# EAGLE design Versatile IO Card (EAGLE 6.5.0)
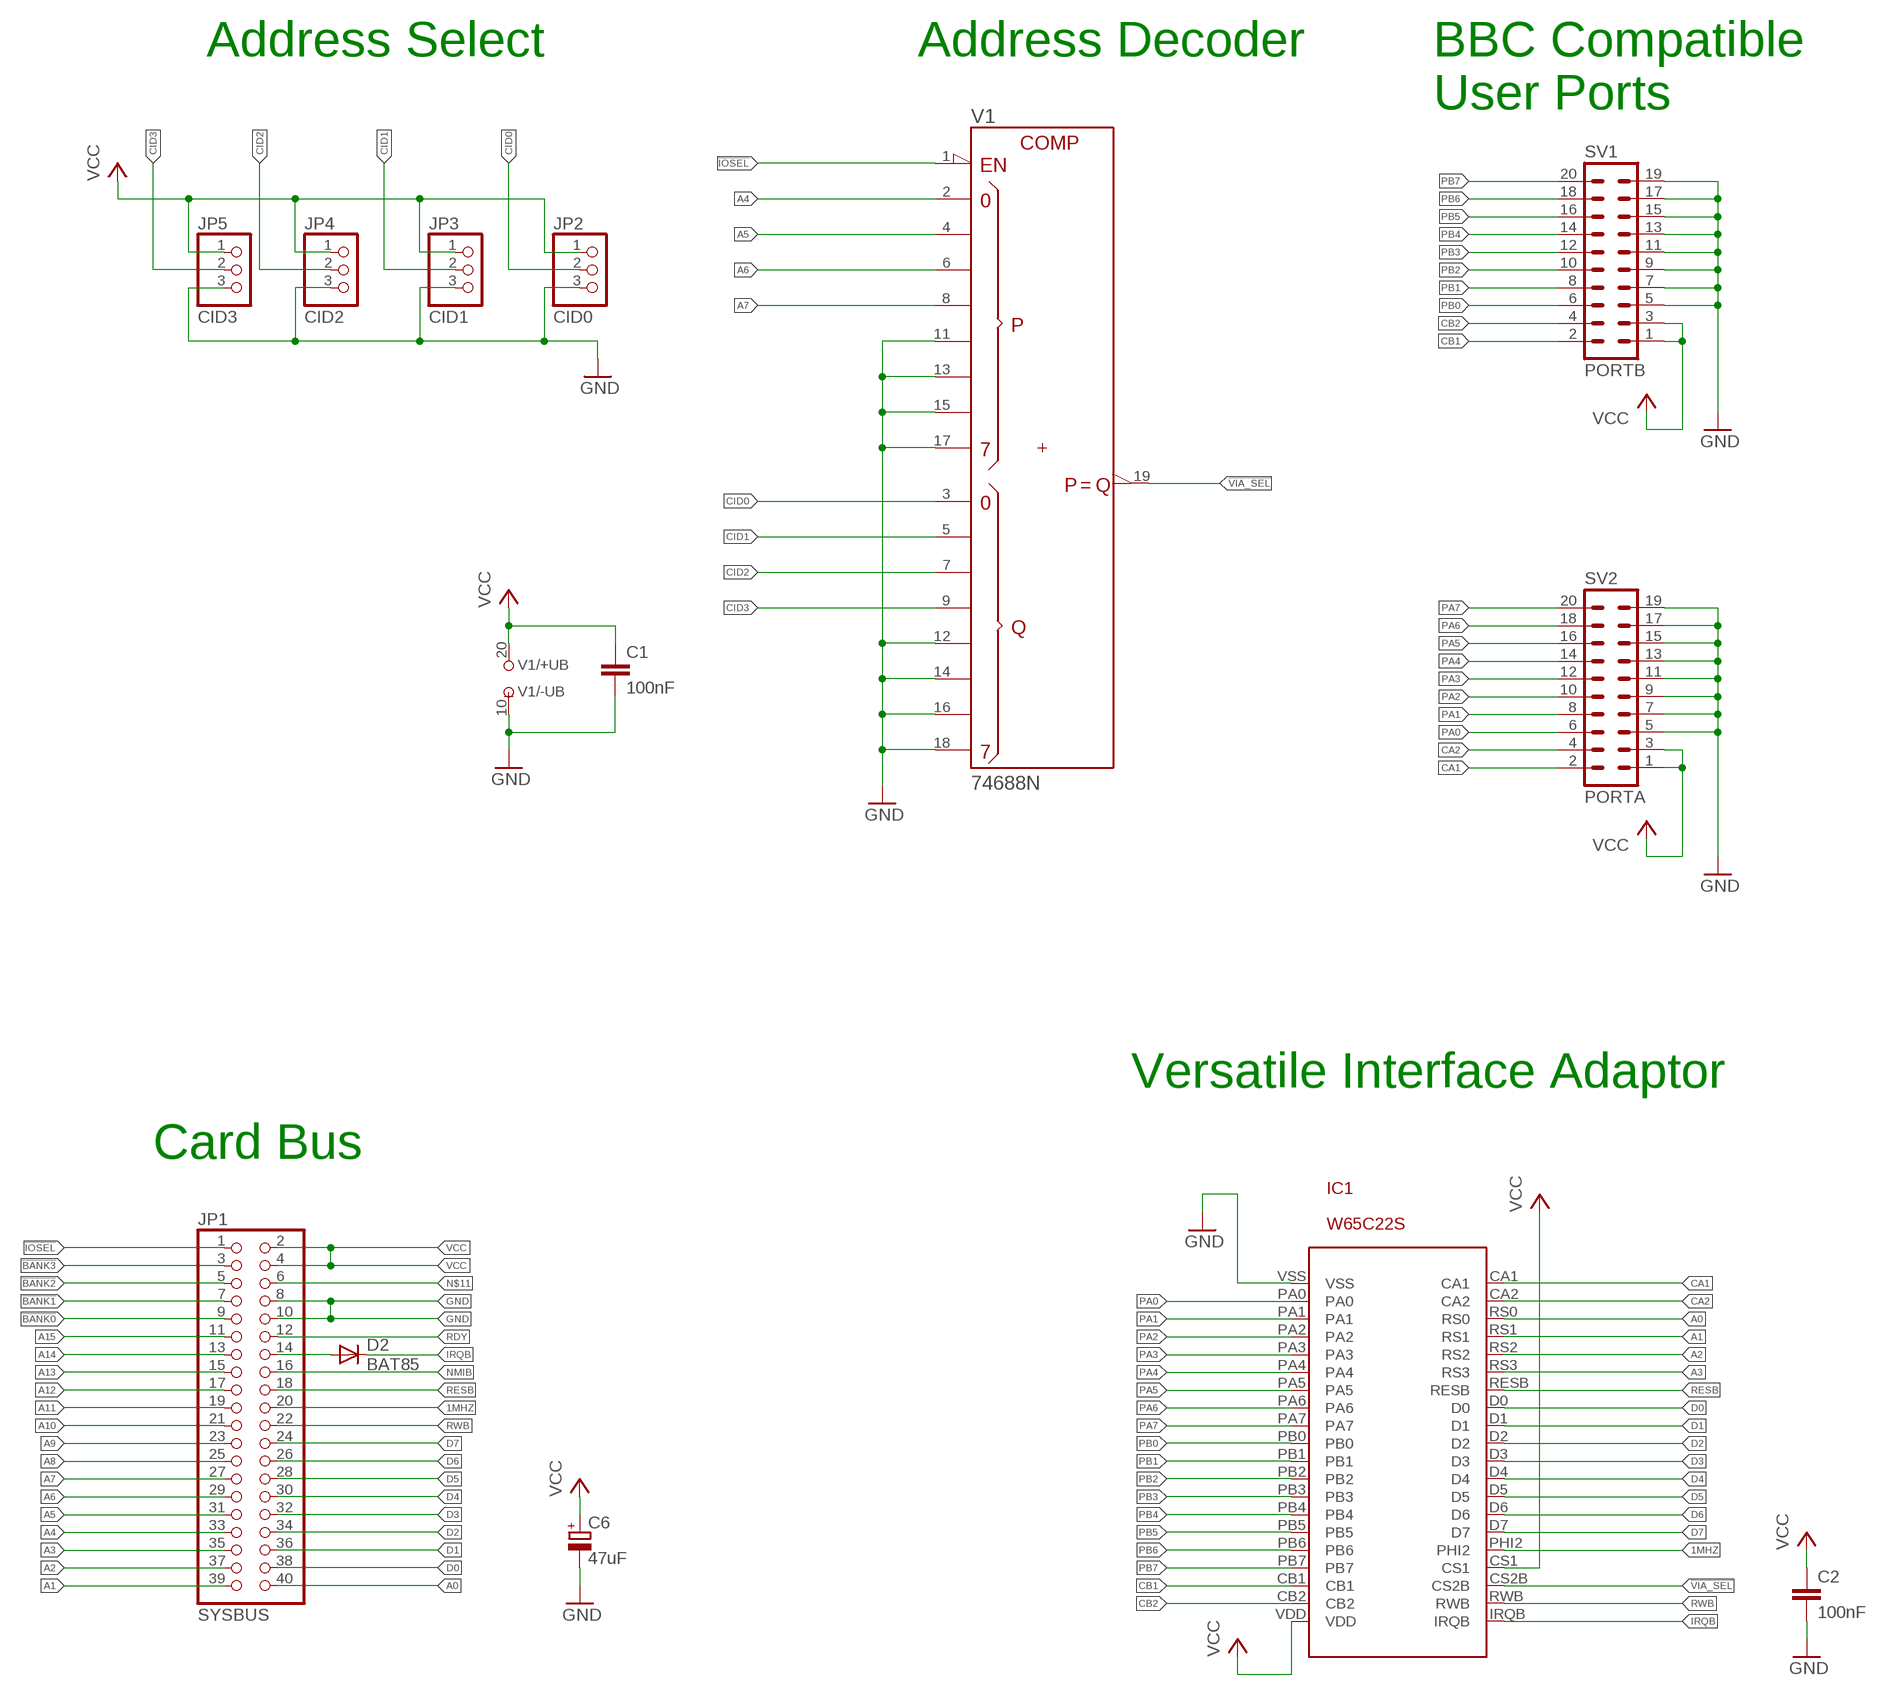
[diagram p0: schematic, sheet 1]

## Parts
C1  100nF  C-EU050-025X075  [C050-025X075]
C2  100nF  C-EU050-025X075  [C050-025X075]
C6  47uF  CPOL-EUE2.5-7  [E2,5-7]
D2  BAT85  BAT81  [DO34-7]
IC1  W65C22S  W65C22  [W65C22-DIP]
JP1  SYSBUS  PINHD-2X20/90  [2X20/90]
JP2  CID0  PINHD-1X3  [1X03]
JP3  CID1  PINHD-1X3  [1X03]
JP4  CID2  PINHD-1X3  [1X03]
JP5  CID3  PINHD-1X3  [1X03]
SV1  PORTB  ML20L  [ML20L]
SV2  PORTA  ML20L  [ML20L]
V1  74688N  [DIL20]

## Nets
1MHZ: IC1.PHI2 JP1.20
!BANK0: JP1.9
!BANK1: JP1.7
!BANK2: JP1.5
!BANK3: JP1.3
!IOSEL: JP1.1 V1.1(!G)
!VIA_SEL: IC1.CS2B V1.19(!P=Q)
A0: IC1.RS0 JP1.40
A1: IC1.RS1 JP1.39
A2: IC1.RS2 JP1.37
A3: IC1.RS3 JP1.35
A4: JP1.33 V1.2(P0)
A5: JP1.31 V1.4(P1)
A6: JP1.29 V1.6(P2)
A7: JP1.27 V1.8(P3)
A8: JP1.25
A9: JP1.23
A10: JP1.21
A11: JP1.19
A12: JP1.17
A13: JP1.15
A14: JP1.13
A15: JP1.11
CA1: IC1.CA1 SV2.2
CA2: IC1.CA2 SV2.4
CB1: IC1.CB1 SV1.2
CB2: IC1.CB2 SV1.4
CID0: JP2.2 V1.3(Q0)
CID1: JP3.2 V1.5(Q1)
CID2: JP4.2 V1.7(Q2)
CID3: JP5.2 V1.9(Q3)
D0: IC1.D0 JP1.38
D1: IC1.D1 JP1.36
D2: IC1.D2 JP1.34
D3: IC1.D3 JP1.32
D4: IC1.D4 JP1.30
D5: IC1.D5 JP1.28
D6: IC1.D6 JP1.26
D7: IC1.D7 JP1.24
GND: C1.2 C2.2 C6.- IC1.VSS JP1.8 JP1.10 JP2.3 JP3.3 JP4.3 JP5.3 SV1.5 SV1.7 SV1.9 SV1.11 SV1.13 SV1.15 SV1.17 SV1.19 SV2.5 SV2.7 SV2.9 SV2.11 SV2.13 SV2.15 SV2.17 SV2.19 V1.10(-UB) V1.11(P4) V1.12(Q4) V1.13(P5) V1.14(Q5) V1.15(P6) V1.16(Q6) V1.17(P7) V1.18(Q7)
IRQB: D2.C IC1.IRQB
N$1: D2.A JP1.14
N$11: JP1.6
NMIB: JP1.16
PA0: IC1.PA0 SV2.6
PA1: IC1.PA1 SV2.8
PA2: IC1.PA2 SV2.10
PA3: IC1.PA3 SV2.12
PA4: IC1.PA4 SV2.14
PA5: IC1.PA5 SV2.16
PA6: IC1.PA6 SV2.18
PA7: IC1.PA7 SV2.20
PB0: IC1.PB0 SV1.6
PB1: IC1.PB1 SV1.8
PB2: IC1.PB2 SV1.10
PB3: IC1.PB3 SV1.12
PB4: IC1.PB4 SV1.14
PB5: IC1.PB5 SV1.16
PB6: IC1.PB6 SV1.18
PB7: IC1.PB7 SV1.20
RDY: JP1.12
RESB: IC1.RESB JP1.18
RWB: IC1.RWB JP1.22
VCC: C1.1 C2.1 C6.+ IC1.CS1 IC1.VDD JP1.2 JP1.4 JP2.1 JP3.1 JP4.1 JP5.1 SV1.1 SV1.3 SV2.1 SV2.3 V1.20(+UB)

## Notes on the sheet
- Address Select | Address Decoder
- BBC Compatible
  User Ports
- Versatile Interface Adaptor
- Card Bus

## Library data of the parts
C1 C2 = rcl:C-EU: CAPACITOR, European symbol
C6 = rcl:CPOL-EU: POLARIZED CAPACITOR, European symbol
D2 = diode:BAT81: DIODE barrier diode
IC1 = W65XX Support:W65C22
JP1 = pinhead:PINHD-2X20: PIN HEADER
JP2-JP5 = pinhead:PINHD-1X3: PIN HEADER
SV1 SV2 = con-ml:ML20L: HARTING; OC_FARNELL: unknown; OC_NEWARK: unknown
V1 = 74ttl-din:74*688: 8-bit MAGNITUDE/IDENTITY COMPARATOR, totem pole

## Board
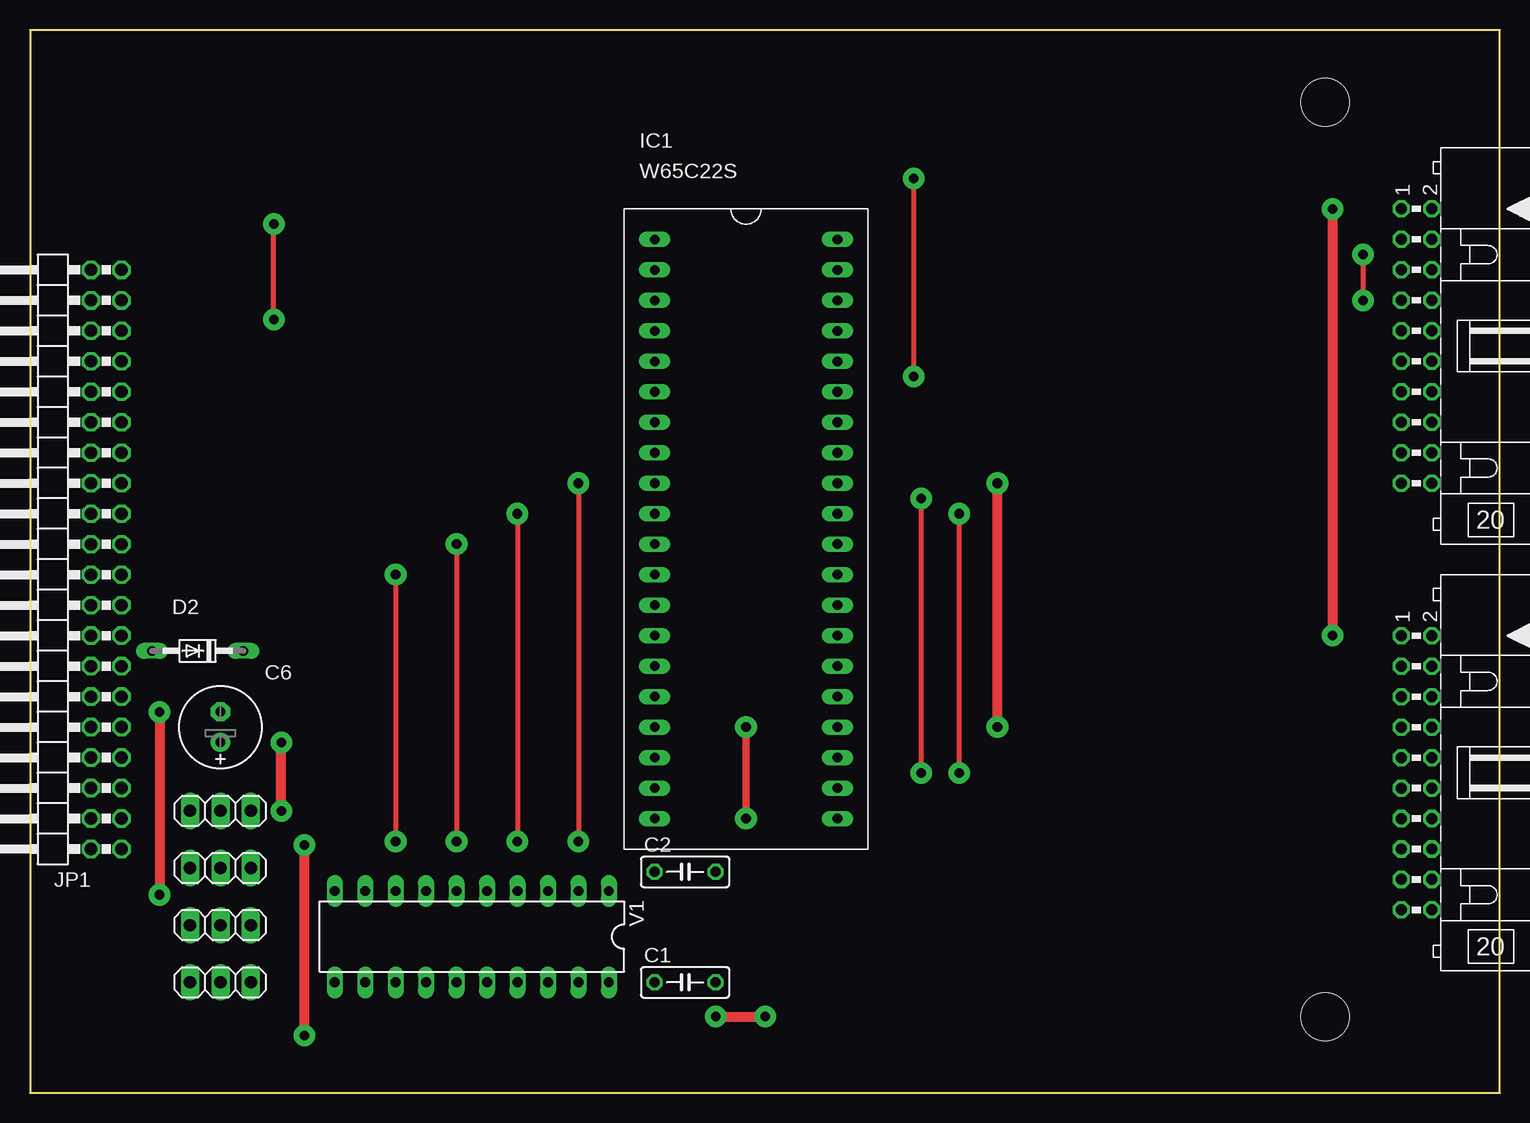
[diagram p1: board, top side]
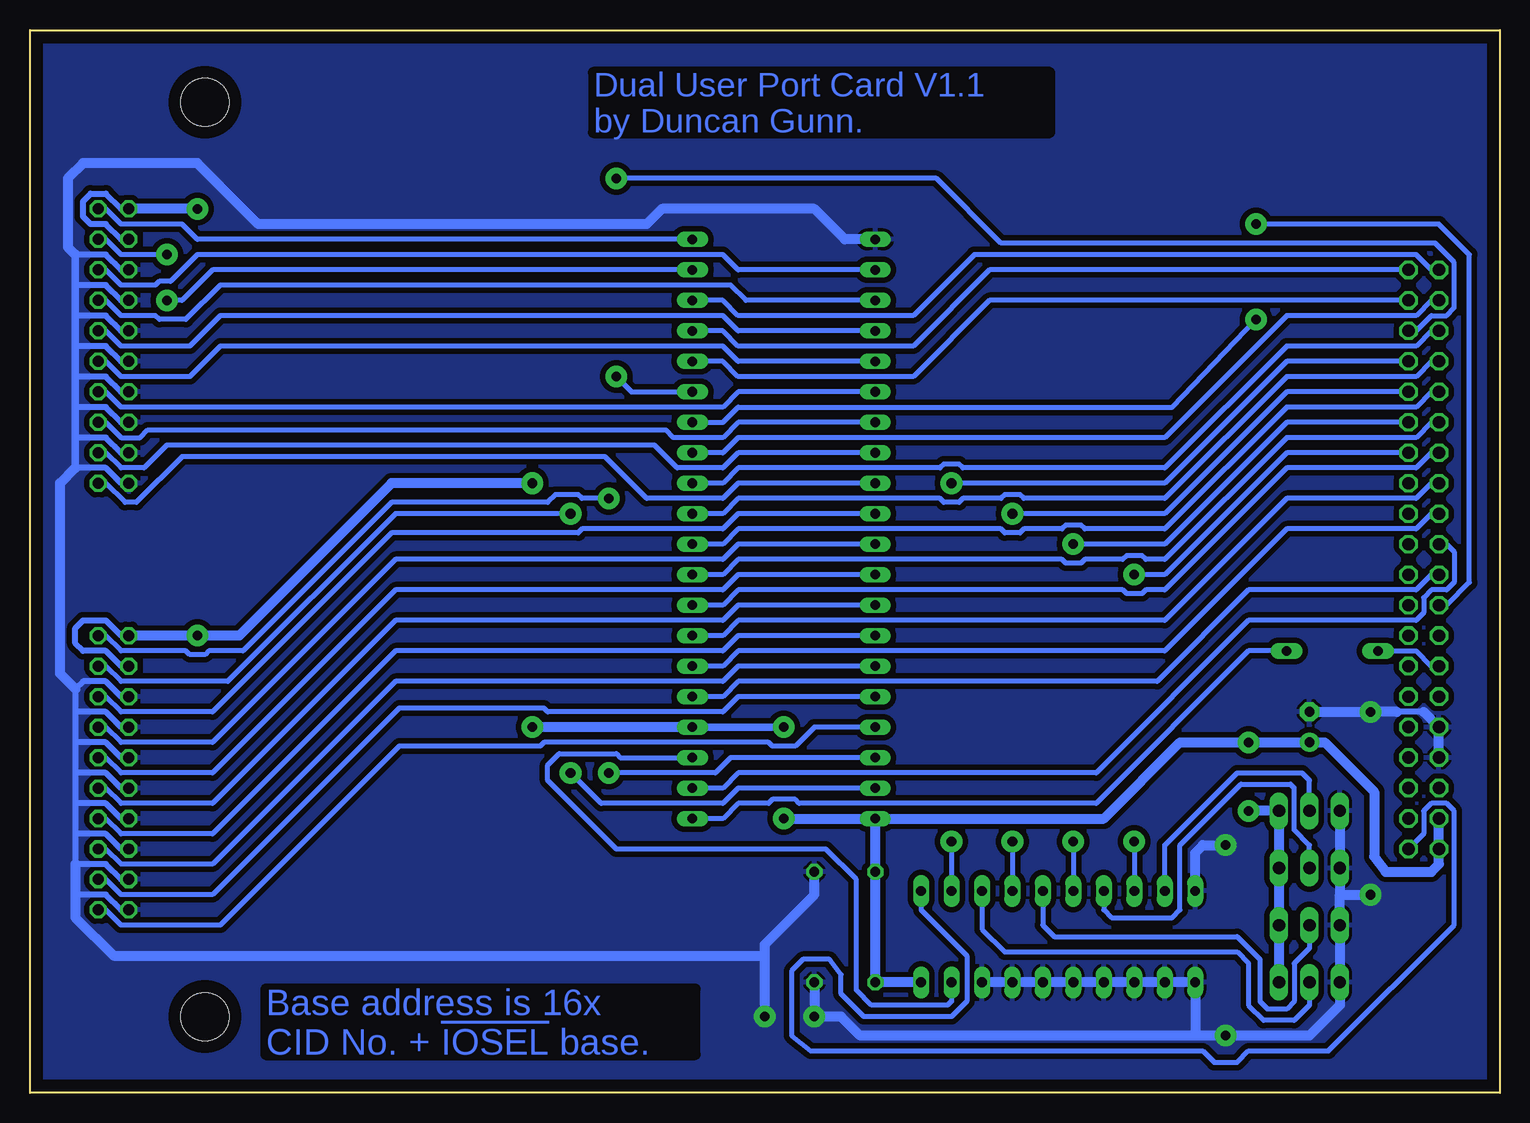
[diagram p2: board, bottom side, seen from below]

Size 122.53 x 88.57 mm. Coordinates in mm from the lower left corner, seen from the top.
Outline: 0,0 122.53,0 122.53,88.57 0,88.57 0,0
Copper layers (1*16): Top 0.035mm / dielectric 1.5mm / Bottom 0.035mm
Design rules "default *": minimum track width 10mil, minimum drill 24mil, track to track 8mil, track to pad 8mil, pad to pad 8mil, via to via 8mil, smd to smd 8mil, copper to edge 40mil, drill to drill 8mil, minimum pad ring 10mil, minimum via ring 8mil, stop-mask expansion 4mil, vias tented up to drill 0mil, thermal gap 10mil
Holes 4 mm at 107.95,82.55 107.95,6.35

### Footprints (pad centres in the part's own frame; a part is rotated, then mirrored left to right if it is on the bottom)
C050-025X075 = drill 0.813 octagon: 1 -2.54,0; 2 2.54,0
E2,5-7 = drill 0.813 pad 1.6: + -1.27,0 | drill 0.813 pad 1.6 octagon: - 1.27,0
DO34-7 = drill 0.813 long: A 3.81,0; C -3.81,0
W65C22-DIP = drill 0.8 long: CA1 7.62,24.13; CA2 7.62,21.59; CB1 -7.62,-19.05; CB2 -7.62,-21.59; CS1 7.62,-16.51; CS2B 7.62,-19.05; D0 7.62,6.35; D1 7.62,3.81; D2 7.62,1.27; D3 7.62,-1.27; D4 7.62,-3.81; D5 7.62,-6.35; D6 7.62,-8.89; D7 7.62,-11.43; IRQB 7.62,-24.13; PA0 -7.62,21.59; PA1 -7.62,19.05; PA2 -7.62,16.51; PA3 -7.62,13.97; PA4 -7.62,11.43; PA5 -7.62,8.89; PA6 -7.62,6.35; PA7 -7.62,3.81; PB0 -7.62,1.27; PB1 -7.62,-1.27; PB2 -7.62,-3.81; PB3 -7.62,-6.35; PB4 -7.62,-8.89; PB5 -7.62,-11.43; PB6 -7.62,-13.97; PB7 -7.62,-16.51; PHI2 7.62,-13.97; RESB 7.62,8.89; RS0 7.62,19.05; RS1 7.62,16.51; RS2 7.62,13.97; RS3 7.62,11.43; RWB 7.62,-21.59; VDD -7.62,-24.13; VSS -7.62,24.13
2X20/90 = drill 1.016 octagon: 1 -24.13,-6.35; 2 -24.13,-3.81; 3 -21.59,-6.35; 4 -21.59,-3.81; 5 -19.05,-6.35; 6 -19.05,-3.81; 7 -16.51,-6.35; 8 -16.51,-3.81; 9 -13.97,-6.35; 10 -13.97,-3.81; 11 -11.43,-6.35; 12 -11.43,-3.81; 13 -8.89,-6.35; 14 -8.89,-3.81; 15 -6.35,-6.35; 16 -6.35,-3.81; 17 -3.81,-6.35; 18 -3.81,-3.81; 19 -1.27,-6.35; 20 -1.27,-3.81; 21 1.27,-6.35; 22 1.27,-3.81; 23 3.81,-6.35; 24 3.81,-3.81; 25 6.35,-6.35; 26 6.35,-3.81; 27 8.89,-6.35; 28 8.89,-3.81; 29 11.43,-6.35; 30 11.43,-3.81; 31 13.97,-6.35; 32 13.97,-3.81; 33 16.51,-6.35; 34 16.51,-3.81; 35 19.05,-6.35; 36 19.05,-3.81; 37 21.59,-6.35; 38 21.59,-3.81; 39 24.13,-6.35; 40 24.13,-3.81
1X03 = drill 1.016 long: 1 -2.54,0; 2 0,0; 3 2.54,0
ML20L = drill 0.914 octagon: 1 -11.43,-1.27; 2 -11.43,1.27; 3 -8.89,-1.27; 4 -8.89,1.27; 5 -6.35,-1.27; 6 -6.35,1.27; 7 -3.81,-1.27; 8 -3.81,1.27; 9 -1.27,-1.27; 10 -1.27,1.27; 11 1.27,-1.27; 12 1.27,1.27; 13 3.81,-1.27; 14 3.81,1.27; 15 6.35,-1.27; 16 6.35,1.27; 17 8.89,-1.27; 18 8.89,1.27; 19 11.43,-1.27; 20 11.43,1.27
DIL20 = drill 0.813 long: 1 -11.43,-3.81; 2 -8.89,-3.81; 3 -6.35,-3.81; 4 -3.81,-3.81; 5 -1.27,-3.81; 6 1.27,-3.81; 7 3.81,-3.81; 8 6.35,-3.81; 9 8.89,-3.81; 10 11.43,-3.81; 11 11.43,3.81; 12 8.89,3.81; 13 6.35,3.81; 14 3.81,3.81; 15 1.27,3.81; 16 -1.27,3.81; 17 -3.81,3.81; 18 -6.35,3.81; 19 -8.89,3.81; 20 -11.43,3.81

### Placement (x,y rotation side)
C1  54.61,9.21 0 top
C2  54.61,18.41 0 top
C6  15.88,30.48 90 top
D2  13.97,36.83 180 top
IC1  59.69,46.99 0 top
JP1  1.27,44.45 90 top
JP2  15.88,9.21 180 top
JP3  15.88,13.97 180 top
JP4  15.88,18.73 180 top
JP5  15.88,23.5 180 top
SV1  115.57,26.67 270 top
SV2  115.57,62.23 270 top
V1  36.83,13.02 180 top

### Tracks (layer width: path | path; a pad name or v marks a point on that pad's centre or on a via)
1MHZ
  Bottom 0.406: JP1.20 5.71,43.18 6.99,41.91 20.95,41.91 28.57,34.29 63.5,34.29 64.77,33.02 IC1.PHI2
!IOSEL
  Bottom 0.406: V1.1 48.26,15.24 44.45,11.43 44.45,7.62 45.72,6.35 53.02,6.35 54.93,8.26 54.93,9.84 55.88,11.11 58.1,11.11 59.05,10.16 59.05,4.76 57.47,3.49 24.77,3.49 23.81,2.54 21.91,2.54 20.95,3.49 14.29,3.49 3.81,13.97 3.81,23.5 4.45,24.13 5.71,24.13 6.35,23.5 6.35,21.59 JP1.1
!VIA_SEL
  Bottom 0.406: V1.19 45.72,7.62 46.04,7.3 52.39,7.3 53.66,8.57 53.66,17.78 56.2,20.32 73.66,20.32 79.38,26.04 79.38,27.3 78.42,28.26 73.66,28.26 73.34,27.94 IC1.CS2B
A0
  Bottom 0.406: JP1.40 5.71,68.58 6.99,69.85 43.81,69.85 48.9,64.77 63.5,64.77 64.77,66.04 IC1.RS0
A1
  Bottom 0.406: JP1.39 42.55,68.58 48.9,62.23 63.5,62.23 64.77,63.5 IC1.RS1
A2
  Bottom 0.406: JP1.37 42.55,66.04 48.9,59.69 63.5,59.69 64.77,60.96 IC1.RS2
A3  (via drill 0.8 pad 1.8)
  Top 0.406: v73.66,76.2 v73.66,59.69
  Bottom 0.406: JP1.35 6.99,63.5 5.71,64.77 4.45,64.77 3.81,65.41 3.81,69.22 5.4,70.8 41.59,70.8 46.99,76.2 v73.66,76.2 | v73.66,59.69 72.39,58.42 IC1.RS3
A4  (via drill 0.8 pad 1.8)
  Top 0.406: v45.72,50.8 v45.72,20.95
  Bottom 0.406: JP1.33 17.78,60.96 27.94,50.8 v45.72,50.8 | v45.72,20.95 V1.2
A5  (via drill 0.8 pad 1.8)
  Top 0.406: v40.64,48.26 v40.64,20.95
  Bottom 0.406: JP1.31 17.78,58.42 27.94,48.26 v40.64,48.26 | v40.64,20.95 V1.4
A6  (via drill 0.8 pad 1.8)
  Top 0.406: v35.56,45.72 v35.56,20.95
  Bottom 0.406: JP1.29 17.78,55.88 27.94,45.72 v35.56,45.72 | v35.56,20.95 V1.6
A7  (via drill 0.8 pad 1.8)
  Top 0.406: v30.48,43.18 v30.48,20.95
  Bottom 0.406: JP1.27 17.78,53.34 27.94,43.18 v30.48,43.18 | v30.48,20.95 V1.8
CA1
  Bottom 0.406: IC1.CA1 108.58,71.12 109.86,72.39 114.94,72.39 116.2,73.66 SV2.2
CA2  (via drill 0.8 pad 1.8)
  Top 0.406: v111.12,66.04 v111.12,69.85
  Bottom 0.406: IC1.CA2 107.31,68.58 109.86,66.04 v111.12,66.04 | v111.12,69.85 114.94,69.85 116.2,71.12 SV2.4
CB1  (via drill 0.8 pad 1.8)
  Top 0.406: v74.3,26.67 v74.3,49.53
  Bottom 0.406: IC1.CB1 64.14,27.94 65.41,26.67 v74.3,26.67 | v74.3,49.53 76.52,49.53 76.83,49.85 78.74,49.85 79.38,49.21 92.39,49.21 104.78,36.83 107.63,36.83 107.95,36.51 109.22,36.51 109.54,36.83 114.94,36.83 116.2,38.1 SV1.2
CB2  (via drill 0.8 pad 1.8)
  Top 0.406: v77.47,26.67 v77.47,48.26
  Bottom 0.406: IC1.CB2 63.5,25.4 64.77,24.13 74.93,24.13 v77.47,26.67 | v77.47,48.26 92.08,48.26 106.05,34.29 114.94,34.29 116.2,35.56 SV1.4
CID0
  Bottom 0.406: JP2.2 15.88,7.3 17.14,6.03 19.68,6.03 20.95,7.3 20.95,10.79 21.91,11.75 41.27,11.75 43.18,13.65 V1.3
CID1
  Bottom 0.406: JP3.2 15.88,12.06 17.14,10.79 17.14,7.62 17.78,6.99 19.37,6.99 20,7.62 20,11.11 21.91,13.02 37.15,13.02 38.1,13.97 V1.5
CID2
  Bottom 0.406: JP4.2 15.88,20.64 17.14,21.91 17.14,25.4 17.46,25.72 21.59,25.72 26.67,20.64 26.67,15.24 27.3,14.61 32.38,14.61 33.02,15.24 V1.7
CID3
  Bottom 0.406: JP5.2 15.88,26.04 16.51,26.67 21.91,26.67 27.94,20.64 V1.9
D0
  Bottom 0.406: JP1.38 5.71,66.04 6.99,64.77 17.78,64.77 27.94,54.61 63.5,54.61 64.77,53.34 IC1.D0
D1
  Bottom 0.406: JP1.36 5.71,63.5 6.99,62.23 17.78,62.23 27.94,52.07 44.77,52.07 45.09,52.39 46.35,52.39 46.67,52.07 63.5,52.07 64.77,50.8 IC1.D1
D2
  Bottom 0.406: JP1.34 5.71,60.96 6.99,59.69 17.78,59.69 27.94,49.53 39.69,49.53 40.01,49.85 41.27,49.85 41.59,49.53 44.77,49.53 45.09,49.21 46.35,49.21 46.67,49.53 63.5,49.53 64.77,48.26 IC1.D2
D3
  Bottom 0.406: JP1.32 5.71,58.42 6.99,57.15 17.78,57.15 27.94,46.99 34.61,46.99 34.92,47.31 36.2,47.31 36.51,46.99 39.69,46.99 40.01,46.67 41.27,46.67 41.59,46.99 63.5,46.99 64.77,45.72 IC1.D3
D4
  Bottom 0.406: JP1.30 5.71,55.88 6.99,54.61 17.78,54.61 27.94,44.45 29.53,44.45 29.84,44.77 31.11,44.77 31.43,44.45 34.61,44.45 34.92,44.13 36.2,44.13 36.51,44.45 63.5,44.45 64.77,43.18 IC1.D4
D5
  Bottom 0.406: JP1.28 5.71,53.34 6.99,52.07 17.78,52.07 27.94,41.91 29.53,41.91 29.84,41.59 31.11,41.59 31.43,41.91 63.5,41.91 64.77,40.64 IC1.D5
D6
  Bottom 0.406: JP1.26 5.71,50.8 6.99,49.53 17.78,49.53 27.94,39.37 63.5,39.37 64.77,38.1 IC1.D6
D7
  Bottom 0.406: JP1.24 5.71,48.26 6.99,46.99 17.78,46.99 27.94,36.83 63.5,36.83 64.77,35.56 IC1.D7
GND  (via drill 0.8 pad 1.8)
  Top 0.813: v22.86,20.64 v22.86,4.76 | v57.15,6.35 v61.28,6.35 | v10.79,31.75 v10.79,16.51
  Bottom 0.508: 6.35,31.75 8.57,31.75 | 118.75,31.75 118.75,33.66 118.11,34.29 116.2,34.29 114.94,33.02 SV1.5 | 118.75,31.75 118.75,29.21 | 118.75,29.21 118.75,26.67 | 118.75,26.67 118.75,24.13 | 118.75,24.13 118.75,21.59 | 118.75,21.59 118.75,19.05 116.2,19.05 114.94,17.78 SV1.17 | 118.75,31.75 116.2,31.75 114.94,30.48 SV1.7 | 118.75,29.21 116.2,29.21 114.94,27.94 SV1.9 | SV1.11 114.94,25.4 116.2,26.67 118.75,26.67 | SV1.13 114.94,22.86 116.2,24.13 118.75,24.13 | SV1.15 114.94,20.32 116.2,21.59 118.75,21.59 | SV1.19 114.94,15.24 116.2,16.51 118.75,16.51 | SV2.19 114.94,50.8 116.2,52.07 118.75,52.07 | SV2.17 114.94,53.34 116.2,54.61 118.75,54.61 | SV2.15 114.94,55.88 116.2,57.15 118.75,57.15 | SV2.13 114.94,58.42 116.2,59.69 118.75,59.69 | SV2.11 114.94,60.96 116.2,62.23 118.75,62.23 | SV2.9 114.94,63.5 116.2,64.77 118.75,64.77 | SV2.7 114.94,66.04 116.2,67.31 118.75,67.31 | SV2.5 114.94,68.58 116.2,69.85 118.75,69.85
  Bottom 0.61: 118.75,52.07 118.75,54.61 118.75,57.15 118.75,59.69 118.75,62.23 118.75,64.77 118.75,67.31 118.75,69.85
  Bottom 0.813: V1.18 V1.17 V1.16 V1.15 V1.14 V1.13 V1.12 V1.11 25.4,4.76 | JP5.3 JP4.3 13.34,16.51 | 25.4,4.76 v22.86,4.76 15.88,4.76 13.34,7.3 JP2.3 JP3.3 13.34,16.51 | 25.4,4.76 53.34,4.76 54.93,6.35 v57.15,6.35 C1.2 | V1.10 25.4,20 24.77,20.64 v22.86,20.64 | 6.35,31.75 JP1.10 JP1.8 | IC1.VSS 54.61,71.12 57.15,73.66 69.85,73.66 71.12,72.39 103.5,72.39 108.58,77.47 118.11,77.47 119.38,76.2 119.38,70.48 118.75,69.85 | 118.75,33.66 120.02,34.92 120.02,50.8 118.75,52.07 | v61.28,6.35 61.28,11.43 | 61.28,11.43 61.28,12.38 57.15,16.51 C2.2 | 118.75,19.05 118.75,16.51 118.75,14.61 115.57,11.43 61.28,11.43 | C6.- v10.79,31.75 8.57,31.75 | 13.34,16.51 v10.79,16.51
  pour Bottom (isolate 0.457): 0,88.27 122.56,88.27 122.56,0 0,0
IRQB
  Bottom 0.406: IC1.IRQB 64.77,22.86 63.5,24.13 60.96,24.13 60.64,24.45 58.74,24.45 58.42,24.13 33.66,24.13 20.95,36.83 D2.C
N$1
  Bottom 0.406: JP1.14 5.71,35.56 6.99,36.83 D2.A
PA0
  Bottom 0.406: IC1.PA0 63.5,68.58 64.77,69.85 108.58,69.85 110.81,67.63 111.76,67.63 112.08,67.31 114.94,67.31 116.2,68.58 SV2.6
PA1
  Bottom 0.406: IC1.PA1 62.87,66.04 64.14,67.31 106.68,67.31 109.54,64.45 111.76,64.45 112.08,64.77 114.94,64.77 116.2,66.04 SV2.8
PA2
  Bottom 0.406: IC1.PA2 63.5,63.5 64.77,64.77 106.68,64.77 109.22,62.23 114.94,62.23 116.2,63.5 SV2.10
PA3
  Bottom 0.406: IC1.PA3 63.5,60.96 64.77,62.23 106.68,62.23 109.22,59.69 114.94,59.69 116.2,60.96 SV2.12
PA4
  Bottom 0.406: IC1.PA4 63.5,58.42 64.77,57.15 114.94,57.15 116.2,58.42 SV2.14
PA5
  Bottom 0.406: IC1.PA5 63.5,55.88 64.77,54.61 68.9,54.61 69.53,55.24 112.71,55.24 113.35,54.61 114.94,54.61 116.2,55.88 SV2.16
PA6
  Bottom 0.406: IC1.PA6 63.5,53.34 64.77,52.07 68.58,52.07 70.48,53.98 111.12,53.98 113.03,52.07 114.94,52.07 116.2,53.34 SV2.18
PA7
  Bottom 0.406: IC1.PA7 63.5,50.8 64.77,49.53 71.12,49.53 74.61,53.02 109.86,53.02 113.67,49.21 114.62,49.21 116.2,50.8 SV2.20
PB0
  Bottom 0.406: IC1.PB0 63.5,48.26 64.77,46.99 76.52,46.99 76.83,46.67 92.39,46.67 107.31,31.75 114.94,31.75 116.2,33.02 SV1.6
PB1
  Bottom 0.406: IC1.PB1 63.5,45.72 64.77,44.45 92.08,44.45 107.31,29.21 114.94,29.21 116.2,30.48 SV1.8
PB2
  Bottom 0.406: IC1.PB2 63.5,43.18 64.77,41.91 92.08,41.91 107.31,26.67 114.94,26.67 116.2,27.94 SV1.10
PB3
  Bottom 0.406: IC1.PB3 63.5,40.64 64.77,39.37 92.08,39.37 107.31,24.13 114.94,24.13 116.2,25.4 SV1.12
PB4
  Bottom 0.406: IC1.PB4 63.5,38.1 64.77,36.83 92.08,36.83 107.31,21.59 114.94,21.59 116.2,22.86 SV1.14
PB5
  Bottom 0.406: IC1.PB5 63.5,35.56 64.77,34.29 92.08,34.29 107.31,19.05 114.94,19.05 116.2,20.32 SV1.16
PB6
  Bottom 0.406: IC1.PB6 63.5,33.02 64.77,31.75 79.38,31.75 79.69,32.07 91.76,32.07 107.31,16.51 114.94,16.51 116.2,17.78 SV1.18
PB7
  Bottom 0.406: IC1.PB7 57.15,30.48 58.74,28.89 60.64,28.89 60.96,29.21 79.69,29.21 80.01,28.89 91.76,28.89 106.68,13.97 114.94,13.97 116.2,15.24 SV1.20
RESB  (via drill 0.8 pad 1.8)
  Top 0.406: v20.32,64.45 v20.32,72.39
  Bottom 0.406: JP1.18 4.45,40.64 2.54,42.55 2.54,69.85 5.08,72.39 v20.32,72.39 | IC1.RESB 64.77,55.88 63.5,57.15 27.3,57.15 v20.32,64.45
RWB
  Bottom 0.406: JP1.22 4.45,45.72 3.81,45.09 3.81,42.55 4.45,41.91 5.71,41.91 6.35,41.27 6.35,40.01 6.99,39.37 20.95,39.37 33.66,26.67 63.5,26.67 64.77,25.4 IC1.RWB
VCC  (via drill 0.8 pad 1.8)
  Top 0.61: v59.69,30.48 v59.69,22.86
  Top 0.813: v20.95,23.5 v20.95,29.21 | v80.64,30.48 v80.64,50.8 | v108.58,38.1 v108.58,73.66
  Bottom 0.508: SV1.3 114.94,35.56 116.2,36.83 118.11,36.83 118.75,37.47 118.75,38.73 118.11,39.37 116.2,39.37 114.94,38.1 SV1.1 | SV2.3 114.94,71.12 116.2,72.39 117.47,72.39 118.11,73.03 118.11,74.3 117.47,74.93 116.2,74.93 114.94,73.66 SV2.1
  Bottom 0.61: IC1.CS1 v59.69,30.48
  Bottom 0.813: JP1.4 JP1.2 5.08,19.05 5.71,18.41 9.53,18.41 10.48,19.68 10.48,25.08 14.61,29.21 C6.+ v20.95,29.21 26.67,29.21 33.02,22.86 IC1.VDD | v59.69,22.86 IC1.VDD | JP2.1 JP3.1 JP4.1 JP5.1 v20.95,23.5 | V1.20 C1.1 C2.1 IC1.VDD | IC1.CS1 v80.64,30.48 | v80.64,50.8 92.39,50.8 105.09,38.1 v108.58,38.1 SV1.1 | v108.58,73.66 SV2.1

### Text on the board
Bottom: Dual User Port Card V1.1 / by Duncan Gunn. | Base address is 16x / CID No. + !IOSEL! base.